# Altium schematic sheet Isolation.SchDoc
size A4
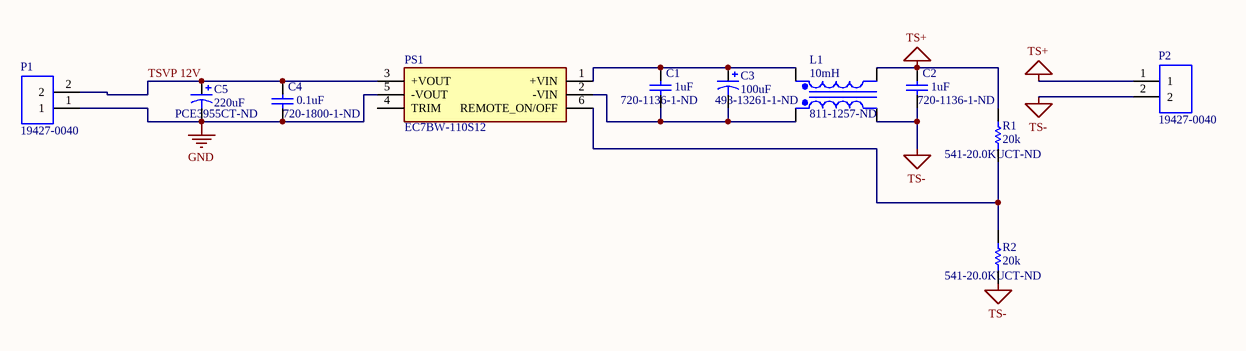
[diagram p0: Isolation.SchDoc]

## Parts
C1  value 1uF  Supplier Part Number 1: 720-1136-1-ND  [2225 Package]  (hidden comment: C0603)
C2  value 1uF  Supplier Part Number 1: 720-1136-1-ND  [2225 Package]  (hidden comment: C0603)
C3  100uF  Supplier Part Number 1: 493-13261-1-ND  [NichiconCAP]
C4  value 0.1uF  Supplier Part Number 1: 720-1800-1-ND  [C1206]  (hidden comment: C0603)
C5  220uF  Supplier Part Number 1: PCE3955CT-ND  [EEE-1VA221UP]
L1  10mH  Supplier Part Number 1: 811-1257-ND  [52106C]
P1  19427-0040  [MX150L 2pin]
P2  19427-0040  [MX150L 2pin]
PS1  EC7BW-110S12  [EC7BW110S12]
R1  20k  Supplier Part Number 1: 541-20.0KUCT-ND  [C1206]
R2  20k  Supplier Part Number 1: 541-20.0KUCT-ND  [C1206]

## Nets
GND: C4.1 C5.2 P1.1 PS1.5(-VOUT)
TS+: C2.2 L1.3 P2.1 R1.2
TS-: C2.1 L1.4 P2.2 R2.1
TSVP 12V: C4.2 C5.1 P1.2 PS1.3(+VOUT)
NetC1_1: C1.1 C3.2 L1.1 PS1.2(-VIN)
NetC1_2: C1.2 C3.1 L1.2 PS1.1(+VIN)
NetPS1_6: PS1.6(REMOTE_ON/OFF) R1.1 R2.2

Not connected (* = marked no-connect by the designer): PS1 4(TRIM)

## Library data of the parts
C1 C2 = C0603_1: C0603C104K3RACTU; Note: Footprint corresponds to dimensions for bulk cassette packaging. This case size has tightened tolerances.; Published: 17-Jul-2002; LatestRevisionDate: 19-Mar-2004; LatestRevisionNote: Silkscreen size reduced.; DatasheetDocument: Mar-2001; PackageDocument: Mar-2001; PackageReference: 0603; Publisher: Altium Limited; Code_JEITA: 0603; Code_IPC: 1608 [0603]; ComponentLink1Description: Manufacturer Link; ComponentLink1URL: http://www.kemet.com/; ComponentLink2Description: Datasheet; ComponentLink2URL: http://www.kemet.com/kemet/web/homepage/kechome.nsf/vapubfilesname/F3102TA.pdf/$file/F3102TA.pdf
C3 = Cap Pol1_1: Nichicon 200V 100uF TH Capacitor  UCA2D101MHD6TN; Value: 100uf
C4 = C0603: C0603C104K3RACTU; Note: Footprint corresponds to dimensions for bulk cassette packaging. This case size has tightened tolerances.; Published: 17-Jul-2002; LatestRevisionDate: 19-Mar-2004; LatestRevisionNote: Silkscreen size reduced.; DatasheetDocument: Mar-2001; PackageDocument: Mar-2001; PackageReference: 0603; Publisher: Altium Limited; Code_JEITA: 0603; Code_IPC: 1608 [0603]; ComponentLink1Description: Manufacturer Link; ComponentLink1URL: http://www.kemet.com/; ComponentLink2Description: Datasheet; ComponentLink2URL: http://www.kemet.com/kemet/web/homepage/kechome.nsf/vapubfilesname/F3102TA.pdf/$file/F3102TA.pdf
C5 = Cap Pol1: Panasonic Electrolytic 35V, 20% EEE-1VA221UP; Value: 220uf
L1 = Trans Ideal: MuRata 52106C Common Choke; Code_IEC: 1005; Published: 8-Jun-2000; LatestRevisionDate: 29-May-2009; LatestRevisionNote: IPC-7351 Footprint Added.; PackageReference: 0402-A; Publisher: Altium Limited; PackageDescription: Chip Inductor; Code_JEITA: 0402
P1 P2 = 19427-0040 MX150L 2pin: MX150L 2pin; Manufacturer_Name: Molex; Manufacturer_Part_Number: 19427-0040; Supplier Part Number 1: WM17504-ND
PS1 = EC7BW-110S12: Power Supply; Manufacturer_Name: Cincon; Datasheet Link: https://www.cincon.com/productdownload/SPEC-EC7BW-110-V13.pdf; Height: 10.7mm; Manufacturer_Part_Number: EC7BW-110S12; Mouser Part Number: 418-EC7BW-110S12; Mouser Price/Stock: https://www.mouser.com/Search/Refine.aspx?Keyword=418-EC7BW-110S12
R1 R2 = ERJ6EN: Precision Thick Film Chip Resistor, 10 Ohm to 2.2M Ohm Range, 1% Tolerance, 0805 Size, 0.1 W; Published: 17-Dec-2003; LatestRevisionDate: 19-Mar-2004; LatestRevisionNote: Silkscreen size reduced.; PackageDocument: Mar-2003; PackageReference: 6-0805; Publisher: Altium Limited; Code_IPC: 2012 [0805]; ComponentLink1Description: Manufacturer Link; ComponentLink1URL: http://www.panasonic.com/industrial/components/resistive_products.htm; ComponentLink2Description: Datasheet; ComponentLink2URL: http://www.panasonic.com/industrial/components/pdf/AOA0000CE2.pdf